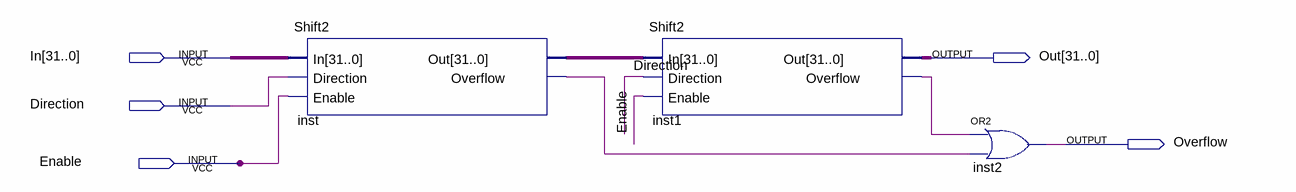
[diagram p0: schematic sheet]
// Quartus schematic Shift4.bdf as structural Verilog: 3 symbols, 5 pins
module Shift4 (
  input  [31:0] In,
  input  Direction,
  input  Enable,
  output [31:0] Out,
  output Overflow
);

  wire inst1_overflow, inst_overflow;
  wire [31:0] inst_out;

  Shift2 inst (.In(In), .Direction(Direction), .Enable(Enable), .Out(inst_out), .Overflow(inst_overflow));
  Shift2 inst1 (.In(inst_out), .Direction(Direction), .Enable(Enable), .Out(Out), .Overflow(inst1_overflow));
  or inst2 (Overflow, inst1_overflow, inst_overflow);
endmodule
